# Altium schematic sheet 14-FPGA-01a.SchDoc
size Tabloid; Customer: 01910; SheetNumber: 14; SheetTotal: 22
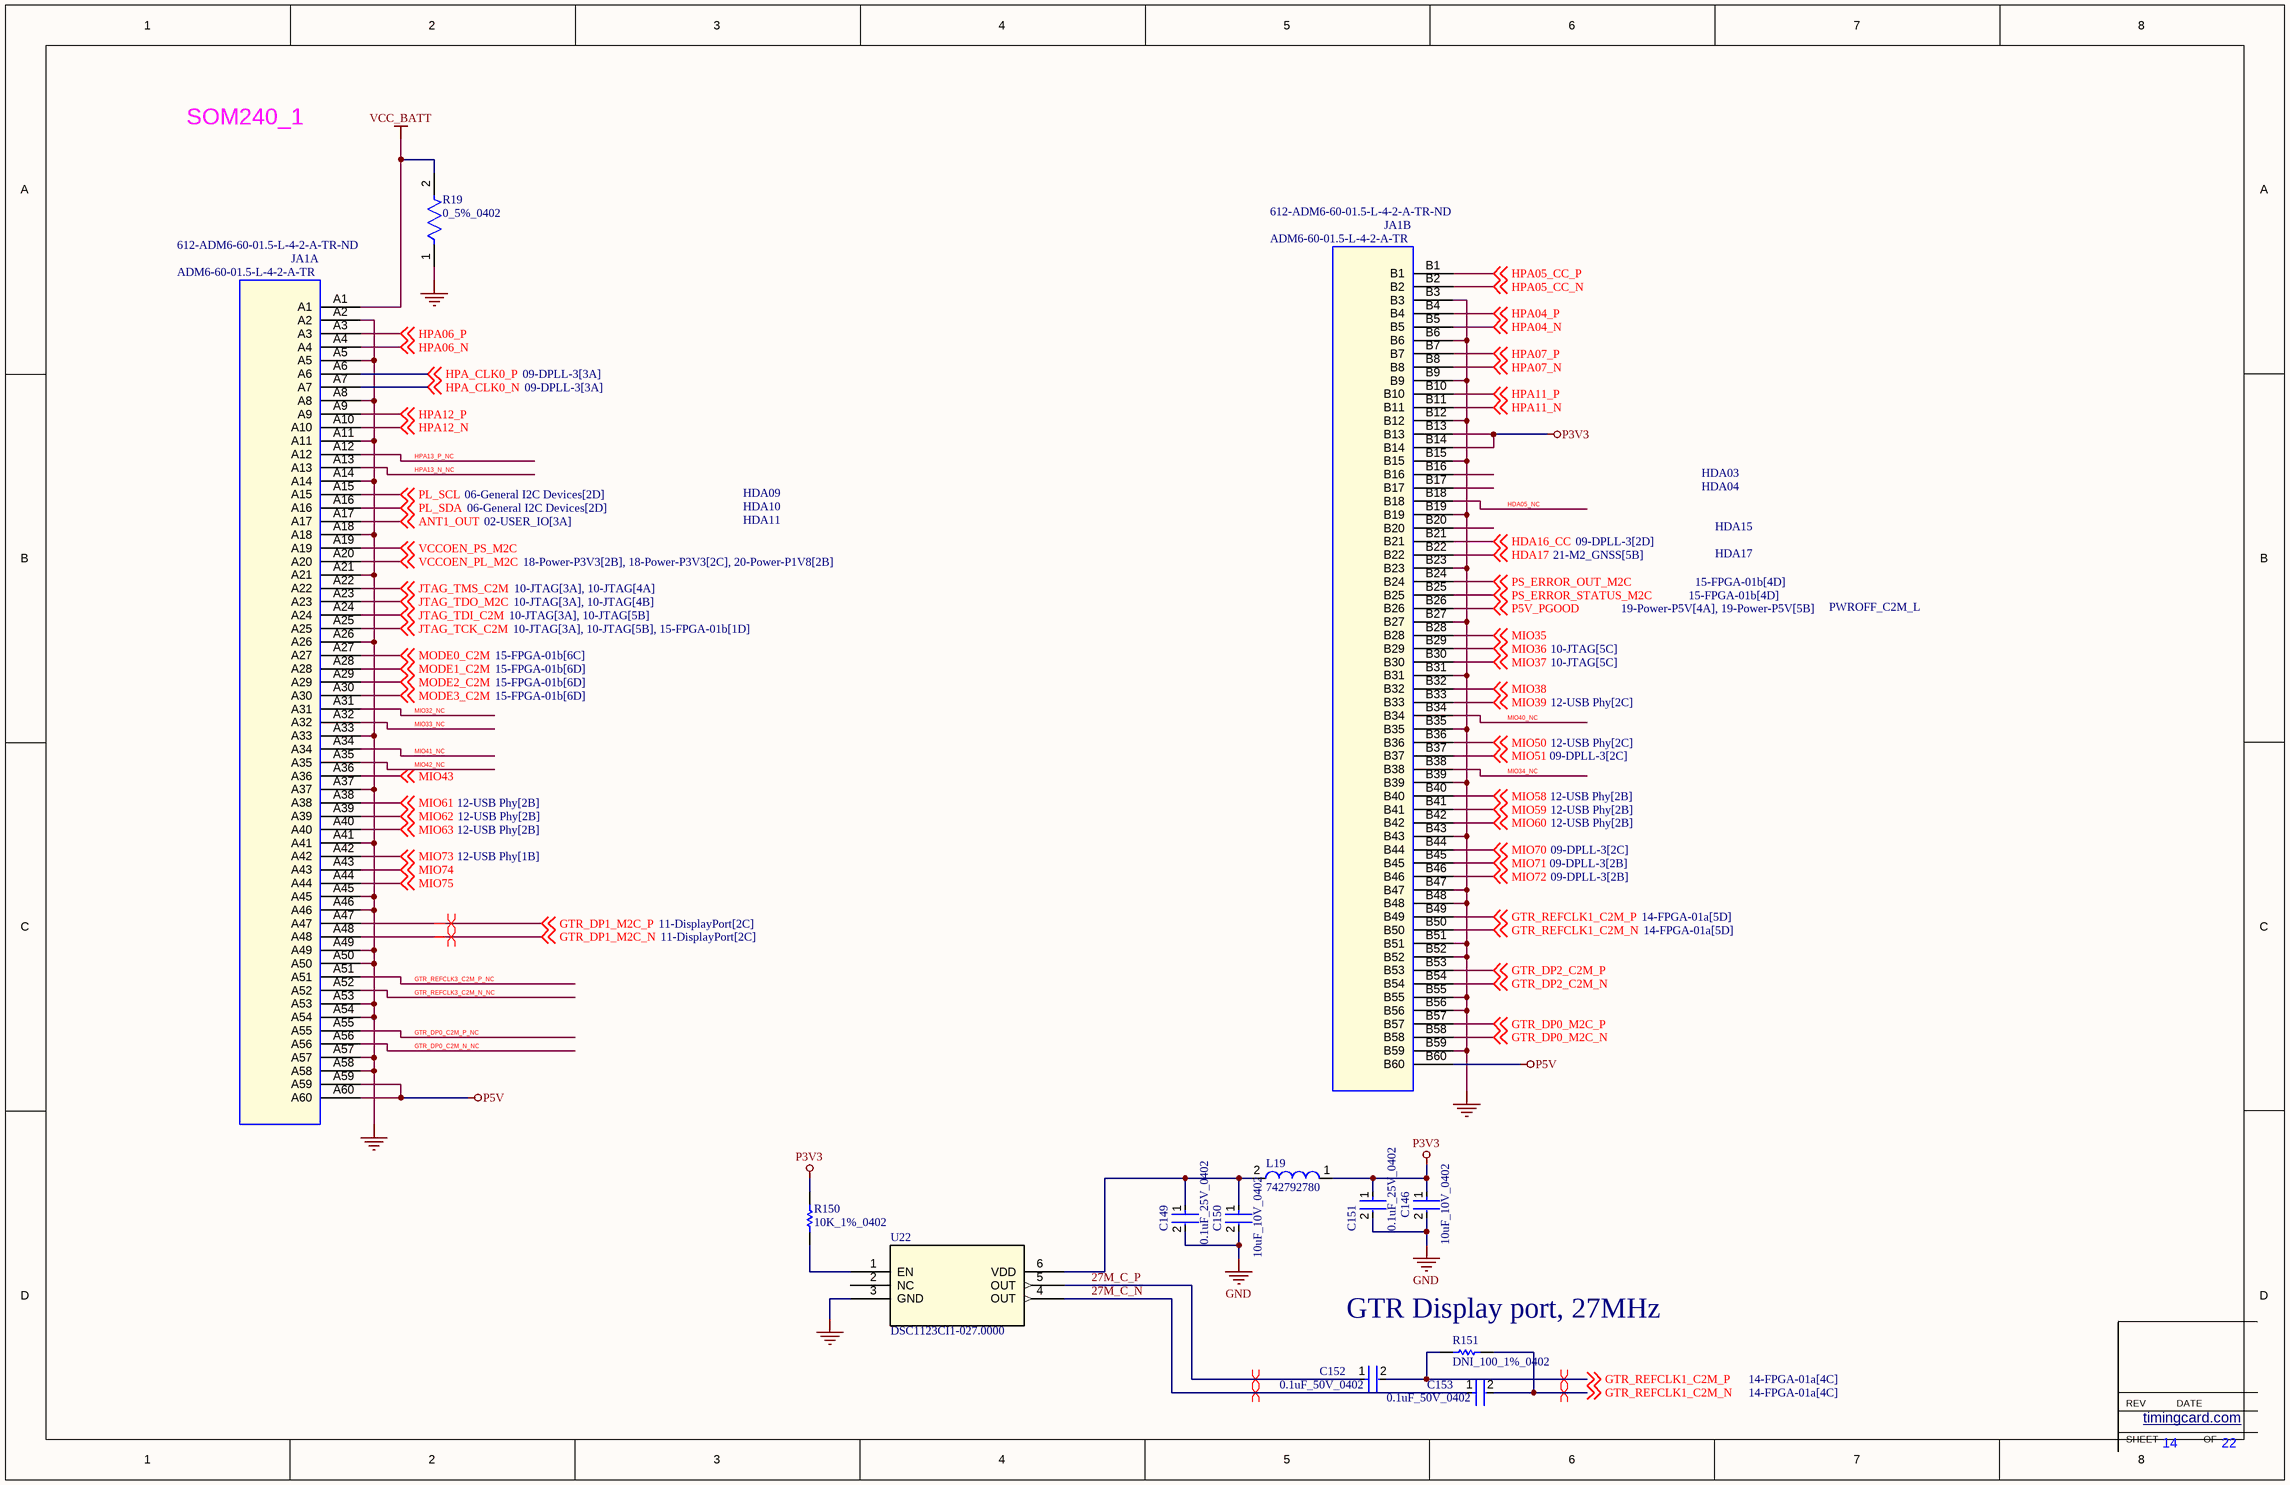
[diagram p0: 14-FPGA-01a.SchDoc]

## Parts
C146  10uF_10V_0402  [FP-CL05A106MP5NUNC-MFG]
C149  0.1uF_25V_0402  [FP-0402-L_1_0_1-W_0_5_0_1-IPC_C]
C150  10uF_10V_0402  [FP-CL05A106MP5NUNC-MFG]
C151  0.1uF_25V_0402  [FP-0402-L_1_0_1-W_0_5_0_1-IPC_C]
C152  0.1uF_50V_0402  [FP-C1005-050-0_05-IPC_C]
C153  0.1uF_50V_0402  [FP-C1005-050-0_05-IPC_C]
JA1  ADM6-60-01.5-L-4-2-A-TR  Supplier Part Number 1: 612-ADM6-60-01.5-L-4-2-A-TR-ND  [CON_SAMTEC_ADM6_60_4]  (parts A,B of 4)
L19  742792780  [SMD-0402]
R19  0_5%_0402  [FP-AC0402-0_37-IPC_B]
R150  10K_1%_0402  [RESC1005X40X25LL05T05]
R151  DNI_100_1%_0402  [RESC1005X40X25ML05T10]  (no BOM)
U22  DSC1123CI1-027.0000  [VDFN6_3P2X2P5_MCH]

## Nets
GND: C146.2 C149.2 C150.2 C151.2 JA1.A2 JA1.A5 JA1.A8 JA1.A11 JA1.A14 JA1.A18 JA1.A21 JA1.A26 JA1.A33 JA1.A37 JA1.A41 JA1.A45 JA1.A46 JA1.A49 JA1.A50 JA1.A53 JA1.A54 JA1.A57 JA1.A58 JA1.B3 JA1.B6 JA1.B9 JA1.B12 JA1.B15 JA1.B19 JA1.B23 JA1.B27 JA1.B31 JA1.B35 JA1.B39 JA1.B43 JA1.B47 JA1.B48 JA1.B51 JA1.B52 JA1.B55 JA1.B56 JA1.B59 R19.1 U22.3(GND)
P3V3: C146.1 C151.1 JA1.B13 JA1.B14 L19.1 R150.2
P5V: JA1.A59 JA1.A60 JA1.B60
VCC_BATT: JA1.A1 R19.2
27M_C_N: C153.1 U22.4(OUT)
27M_C_P: C152.1 U22.5(OUT)
ANT1_OUT: JA1.A17 ; off-sheet ANT1_OUT
GTR_DP0_C2M_N_NC: JA1.A56
GTR_DP0_C2M_P_NC: JA1.A55
GTR_DP0_M2C_N: JA1.B58 ; off-sheet GTR_DP0_M2C_N
GTR_DP0_M2C_P: JA1.B57 ; off-sheet GTR_DP0_M2C_P
GTR_DP1_M2C_N: JA1.A48 ; off-sheet GTR_DP1_M2C_N
GTR_DP1_M2C_P: JA1.A47 ; off-sheet GTR_DP1_M2C_P
GTR_DP2_C2M_N: JA1.B54 ; off-sheet GTR_DP2_C2M_N
GTR_DP2_C2M_P: JA1.B53 ; off-sheet GTR_DP2_C2M_P
GTR_REFCLK1_C2M_N: C153.2 JA1.B50 R151.2 ; off-sheet GTR_REFCLK1_C2M_N
GTR_REFCLK1_C2M_P: C152.2 JA1.B49 R151.1 ; off-sheet GTR_REFCLK1_C2M_P
GTR_REFCLK3_C2M_N_NC: JA1.A52
GTR_REFCLK3_C2M_P_NC: JA1.A51
HDA05_NC: JA1.B18
HDA16_CC: JA1.B21 ; off-sheet HDA16_CC
HDA17: JA1.B22 ; off-sheet HDA17
HPA04_N: JA1.B5 ; off-sheet HPA04_N
HPA04_P: JA1.B4 ; off-sheet HPA04_P
HPA05_CC_N: JA1.B2 ; off-sheet HPA05_CC_N
HPA05_CC_P: JA1.B1 ; off-sheet HPA05_CC_P
HPA06_N: JA1.A4 ; off-sheet HPA06_N
HPA06_P: JA1.A3 ; off-sheet HPA06_P
HPA07_N: JA1.B8 ; off-sheet HPA07_N
HPA07_P: JA1.B7 ; off-sheet HPA07_P
HPA11_N: JA1.B11 ; off-sheet HPA11_N
HPA11_P: JA1.B10 ; off-sheet HPA11_P
HPA12_N: JA1.A10 ; off-sheet HPA12_N
HPA12_P: JA1.A9 ; off-sheet HPA12_P
HPA13_N_NC: JA1.A13
HPA13_P_NC: JA1.A12
HPA_CLK0_N: JA1.A7 ; off-sheet HPA_CLK0_N
HPA_CLK0_P: JA1.A6 ; off-sheet HPA_CLK0_P
JTAG_TCK_C2M: JA1.A25 ; off-sheet JTAG_TCK_C2M
JTAG_TDI_C2M: JA1.A24 ; off-sheet JTAG_TDI_C2M
JTAG_TDO_M2C: JA1.A23 ; off-sheet JTAG_TDO_M2C
JTAG_TMS_C2M: JA1.A22 ; off-sheet JTAG_TMS_C2M
MIO32_NC: JA1.A31
MIO33_NC: JA1.A32
MIO34_NC: JA1.B38
MIO35: JA1.B28 ; off-sheet MIO35
MIO36: JA1.B29 ; off-sheet MIO36
MIO37: JA1.B30 ; off-sheet MIO37
MIO38: JA1.B32 ; off-sheet MIO38
MIO39: JA1.B33 ; off-sheet MIO39
MIO40_NC: JA1.B34
MIO41_NC: JA1.A34
MIO42_NC: JA1.A35
MIO43: JA1.A36 ; off-sheet MIO43
MIO50: JA1.B36 ; off-sheet MIO50
MIO51: JA1.B37 ; off-sheet MIO51
MIO58: JA1.B40 ; off-sheet MIO58
MIO59: JA1.B41 ; off-sheet MIO59
MIO60: JA1.B42 ; off-sheet MIO60
MIO61: JA1.A38 ; off-sheet MIO61
MIO62: JA1.A39 ; off-sheet MIO62
MIO63: JA1.A40 ; off-sheet MIO63
MIO70: JA1.B44 ; off-sheet MIO70
MIO71: JA1.B45 ; off-sheet MIO71
MIO72: JA1.B46 ; off-sheet MIO72
MIO73: JA1.A42 ; off-sheet MIO73
MIO74: JA1.A43 ; off-sheet MIO74
MIO75: JA1.A44 ; off-sheet MIO75
MODE0_C2M: JA1.A27 ; off-sheet MODE0_C2M
MODE1_C2M: JA1.A28 ; off-sheet MODE1_C2M
MODE2_C2M: JA1.A29 ; off-sheet MODE2_C2M
MODE3_C2M: JA1.A30 ; off-sheet MODE3_C2M
P5V_PGOOD: JA1.B26 ; off-sheet P5V_PGOOD
PL_SCL: JA1.A15 ; off-sheet PL_SCL
PL_SDA: JA1.A16 ; off-sheet PL_SDA
PS_ERROR_OUT_M2C: JA1.B24 ; off-sheet PS_ERROR_OUT_M2C
PS_ERROR_STATUS_M2C: JA1.B25 ; off-sheet PS_ERROR_STATUS_M2C
VCCOEN_PL_M2C: JA1.A20 ; off-sheet VCCOEN_PL_M2C
VCCOEN_PS_M2C: JA1.A19 ; off-sheet VCCOEN_PS_M2C
NetC149_1: C149.1 C150.1 L19.2 U22.6(VDD)
NetR150_1: R150.1 U22.1(EN)

Not connected (* = marked no-connect by the designer): JA1 B16 B17 B20; U22 2(NC)

## Layout directives
differential pair: 27M_C_N, 27M_C_P, GTR_DP1_M2C_N, GTR_DP1_M2C_P, GTR_REFCLK1_C2M_N, GTR_REFCLK1_C2M_P

## Notes on the sheet
- SOM240_1
- HDA09
- HDA03
- HDA04
- HDA10
- HDA11
- HDA15
- HDA17
- PWROFF_C2M_L
- (near R151) GTR Display port, 27MHz
- SHEET
- REV
- timingcard.com <http://timingcard.com>
- DATE
- OF

## Library data of the parts
C146 C150 = CMP-13271-000002-1: CAP CER 10UF 10V X5R 0402; Manufacturer Part Number: CL05A106MP5NUNC; Manufacturer: Samsung; Temperature Coefficient: 15%; Tolerance: 20%; Material: Ceramic; Octopart: https://octopart.com/cl05a106mp5nunc-samsung-22457395; Voltage Rating: 10V; RoHS: TRUE; Value: 10uF; Height: 0.7mm; Digikey Description: CAP CER 10UF 10V X5R 0402; Automotive: No; Package: CL05A106MP5NUNC; Device Class L1: Passive Components; Capacitance: 10uF; Temperature Range High: +85°C; ComponentLink2Description: Datasheet; Device Class L2: Capacitors; Temperature Characteristic: X5R; Temperature: -55°C to +85°C; ComponentLink2URL: http://www.samsungsem.com/kr/support/product-search/mlcc/__icsFiles/afieldfile/2019/05/10/19-CL05A106MP5NUNC.pdf; Device Class L3: Ceramic Capacitors; Category: Cap; Temperature Range Low: -55°C; Ipc Land Pattern Name: CAPC10050X50; Lead Free: Yes
C149 C151 = CMP-2008-02519-2: General Purpose Ceramic Capacitor, 0402, 100nF, 10%, X7R, 15%, 25V; Package Quantity: 1; Capacitance: 100nF; Min Operating Temperature: -55°C; Voltage: 25V; Voltage Rating: 25V; Construction: Flat; Max Operating Temperature: 125°C; Radiation Hardening: No; Depth: 0.5mm; Thickness: 0.022inch; Voltage Rating (DC): 25V; Number of Pins: 2; Lead Free: Lead Free; Series: -; REACH SVHC: No SVHC; Length: 1mm; Dielectric: X7R; RoHS Compliant: Yes; Mount: Surface Mount; Packaging: Tape and Reel; Case/Package: 0402; Case Code (Imperial): 0402; Termination: SMD/SMT; Width: 0.02inch; Case Code (Metric): 1005; Tolerance: 10%
C152 C153 = CMP-2000-05393-2: Multilayer Ceramic Capacitors 100nF ±10% 50V X7R SMD 0402; Voltage: 50V; Dielectric Material: Ceramic; Min Operating Temperature: -55°C; Depth: 0.5mm; Radiation Hardening: No; RoHS Compliant: Yes; Voltage Rating (DC): 50V; Lead Free: Lead Free; Resistor Type: Ceramic; Height: 0.5mm; Dielectric: X7R; Thickness: 0.022inch; Case/Package: 0402; Case Code (Metric): 1005; Termination: SMD/SMT; Capacitance: 100nF; Packaging: Tape and Reel; Max Operating Temperature: 125°C; Mount: Surface Mount; Package Quantity: 1; Width: 0.02inch; Weight: 2.3E-05oz; Voltage Rating: 50V; Tolerance: 10%; Construction: Flat; Case Code (Imperial): 0402; Length: 1mm; REACH SVHC: No SVHC; Series: C
JA1 = SAMTEC-ADx6-60X4: Conn Rcpt Male Vert 240 Pos 4x60 0.635mm P Black SMT; Manufacturer: Samtec Inc.; Agile Part Number: CON-00383-01; SPLIT_INST: TRUE; SWAP_INFO: (S1+S2+S3+S4); Pitch: 0.025" (0.64mm); Barcode: 40000092; Datasheet: http://suddendocs.samtec.com/catalog_english/adf6.pdf; Manufacturer PN: ADM6-60-01.5-L-4-2-A-TR; PCB Footprint: CON_SAMTEC_ADM6_60_4; CIP Link: http://xsjbrdwin1/CIP-E/Component/Index/All?pn=40000092; Number of Pins: 240; Part Type: CONNECTOR; Supplier 1: Digi-Key
L19 = CMP-0220-00137-1: SMD EMI Suppression Ferrite Bead WE-CBF, Z = 220 Ohm; Impedance: 220 Ohm; PackageVersion: 2009; DatasheetVersion: ver 4, Jul-2009; PackageDescription: Chip Inductor, 2-Leads, Body 1.0 x 0.5 mm; ComponentLink1URL: http://www.we-online.com; ComponentLink1Description: Manufacturer Link; ComponentLink2URL: http://www.we-online.de/katalog/media/pdf/742792780.pdf; PackageReference: SMD-0402; ComponentLink2Description: Datasheet
R19 = CMP-2002-01772-2: RESISTOR 0402 JUMPER ZERO OHM; Voltage Rating: 50V; Temperature Coefficient: 200ppm/°C; Tolerance: 1%; Power Rating: 62.5mW; Resistance: 0R; Min Operating Temperature: -55°C; Termination: SMD/SMT; Case/Package: 0402; Case Code (Imperial): 0402; Packaging: Tape and Reel; Case Code (Metric): 1005; Max Operating Temperature: 155°C; Series: AC
R150 = CMP-2000-07588-1: Chip Resistor, 10 KOhm, +/- 1%, 0.1 W, -55 to 155 degC, 0402 (1005 Metric), RoHS, Tape and Reel; Manufacturer: Panasonic; Power Rating: 100mW; Voltage Rating: 50V; Resistance: 10KOhm; Case\/Package: 0402; Temperature Coefficient: 100ppm\/degreesC; RoHSCompliant: True; Lead Free: LeadFree; Package Quantity: 1; Contact Plating: Tin; Length: 1mm; Radiation Hardening: No; REACH SVHC: NoSVHC; Max Operating Temperature: 155degC; Depth: 0.5mm; Case Code (Imperial): 0402; Military Standard: Not; Package Description: 2-Pin Surface Mount Device, Body 1 x 0.5 mm; Termination: SMD/SMT; Case Code (Metric): 1005; Height: 0.35mm; Packaging: TapeandReel; Voltage Rating (DC): 50V; Package Reference: 402; Number of Pins: 2; Tolerance: 1%; Mounting Technology: SurfaceMount; Width: 0.02inch; Mount: SurfaceMount; Datasheet URL: https://industrial.panasonic.com/cdbs/www-data/pdf/RDA0000/AOA0000C304.pdf; Composition: ThickFilm; Datasheet Version: 02/2017; Manufacturer URL: http://www.panasonic.com/; Max Power Dissipation: 100mW; Number of Terminations: 2; Min Operating Temperature: -55degC
R151 = CMP-2002-06458-1: Part Number: ERJ-U02F1000X; Manufacturer: Panasonic
U22 = DSC1123CI1-027.0000: No Description Available; Mfr_Name: Microchip; RefDes: RefDes; Type: Type